# Altium schematic sheet sync-demod-ic.SchDoc: ADA2200
size A4; DrawnBy: Dylan Vogel; Organization: UTAT SS; DocumentNumber: 10; Revision: 2; SheetNumber: 10; SheetTotal: 13
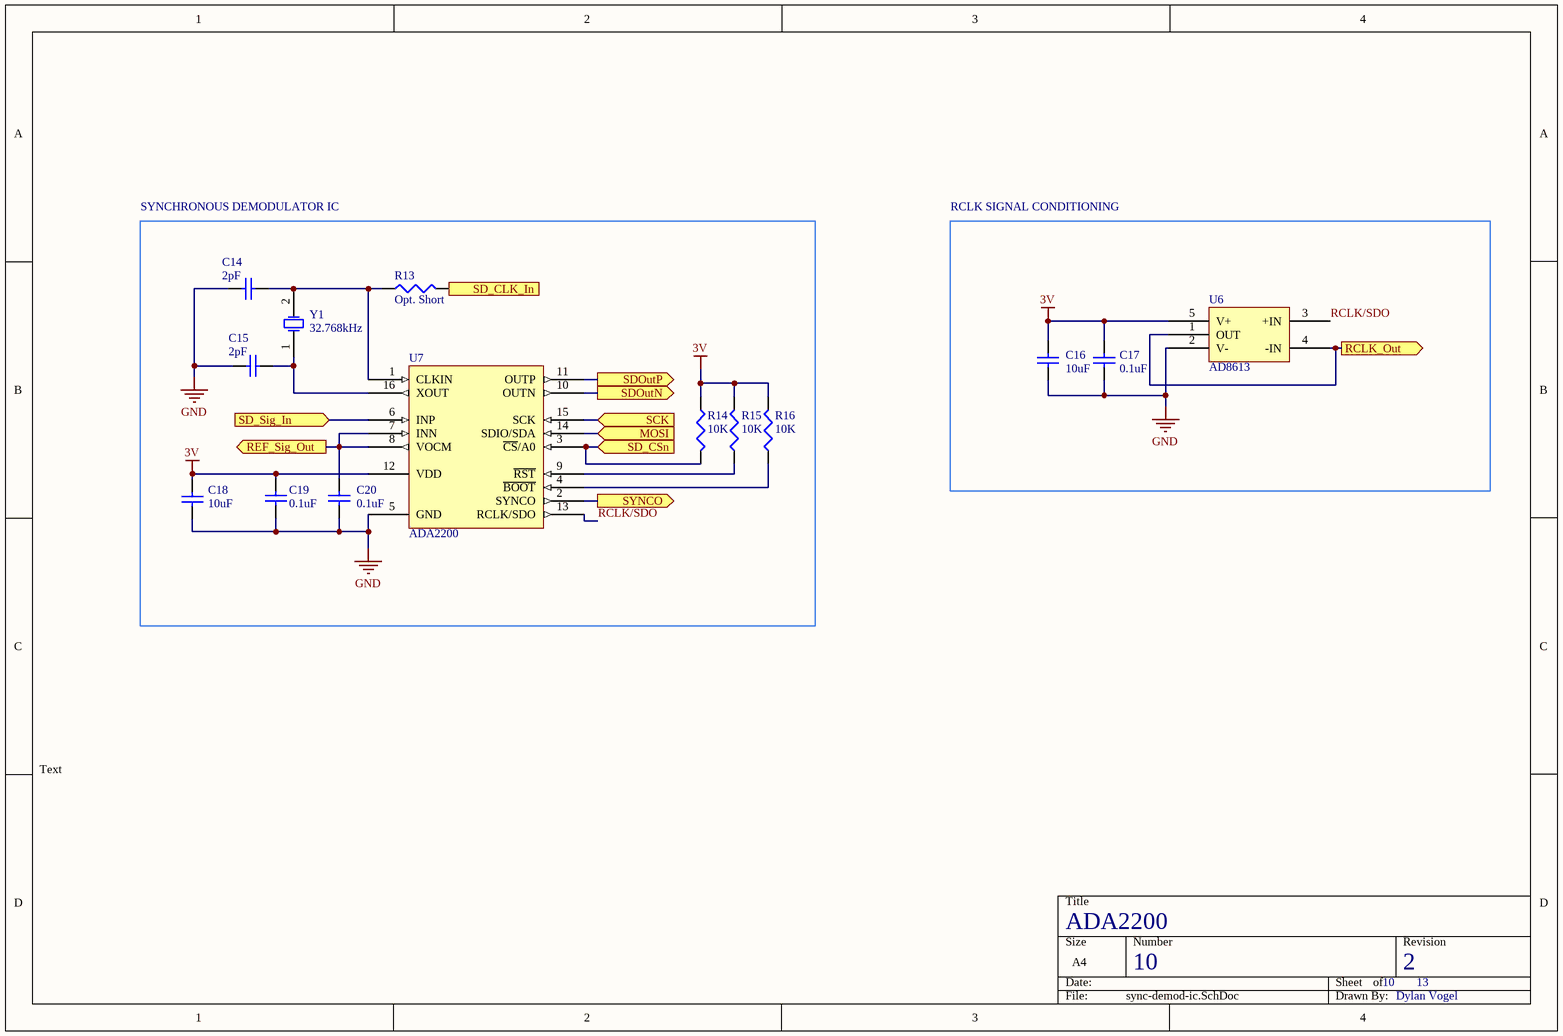
[diagram p0: sync-demod-ic.SchDoc]

## Parts
C14  2pF  [0402]
C15  2pF  [0402]
C16  10uF  [1608[0603]]
C17  0.1uF  [0402]
C18  10uF  [1608[0603]]
C19  0.1uF  [0402]
C20  0.1uF  [0402]
R13  Opt. Short  [0402]
R14  10K  [0402]
R15  10K  [0402]
R16  10K  [0402]
U6  AD8613  [SOP-65P200X125-5N]
U7  ADA2200  [SSOP16_N]
Y1  32.768kHz  [ABS07-120-32.768]

## Blocks framed on the sheet
SYNCHRONOUS DEMODULATOR IC: C14 C15 C18-C20 R13-R16 U7 Y1
RCLK SIGNAL CONDITIONING: C16 C17 U6

## Ports
MOSI (in), RCLK_Out (out), REF_Sig_Out (out), SCK (in), SD_CLK_In (in), SD_CSn (in), SD_Sig_In (in), SDOutN (out), SDOutP (out), SYNCO (out)

## Nets
3V: C16.2 C17.2 C18.1 C19.2 R14.1 R15.2 R16.2 U6.5(V+) U7.12(VDD)
GND: C14.2 C15.2 C16.1 C17.1 C18.2 C19.1 C20.1 U6.2(V-) U7.5(GND)
MOSI: U7.14(SDIO/SDA) ; port MOSI
RCLK/SDO: U6.3(+IN) U7.13(RCLK/SDO)
RCLK_Out: U6.1(OUT) U6.4(-IN) ; port RCLK_Out
REF_Sig_Out: C20.2 U7.7(INN) U7.8(VOCM) ; port REF_Sig_Out
SCK: U7.15(SCK) ; port SCK
SD_CLK_In: R13.2 ; port SD_CLK_In
SD_CSn: R14.2 U7.3(~{CS}/A0) ; port SD_CSn
SD_Sig_In: U7.6(INP) ; port SD_Sig_In
SDOutN: U7.10(OUTN) ; port SDOutN
SDOutP: U7.11(OUTP) ; port SDOutP
SYNCO: U7.2(SYNCO) ; port SYNCO
NetC14_1: C14.1 R13.1 U7.1(CLKIN) Y1.2(OSC2)
NetC15_1: C15.1 U7.16(XOUT) Y1.1(OSC1)
NetR15_1: R15.1 U7.9(~{RST})
NetR16_1: R16.1 U7.4(~{BOOT})

## Notes on the sheet
- Text

## Library data of the parts
C14-C20 = Cap Semi: Capacitor (Semiconductor SIM Model); Published: 8-Jun-2000; LatestRevisionDate: 29-May-2009; LatestRevisionNote: IPC-7351 Footprint Added.; PackageReference: C1206; Publisher: Altium Limited; PackageDescription: Chip Capacitor; Supplier: Digi-Key; Supplier 1: Digi-Key
  C14 C15: Value: 2pF
  C16 C18: Value: 10uF
  C17 C19 C20: Value: 0.1uF
R13 = Res3: Optional short to connect 32M1 rather than Y1; Value: 0 Ohm; Published: 8-Jun-2000; LatestRevisionDate: 29-May-2009; LatestRevisionNote: IPC-7351 Footprint Added.; PackageReference: J1-0603; Publisher: Altium Limited; PackageDescription: Chip Resistor; Supplier: Digi-Key; Supplier 1: Digi-Key
R14-R16 = Res3: Resistor; Published: 8-Jun-2000; LatestRevisionDate: 29-May-2009; LatestRevisionNote: IPC-7351 Footprint Added.; PackageReference: J1-0603; Publisher: Altium Limited; PackageDescription: Chip Resistor; Value: 10K; Supplier: Digi-Key; Supplier 1: Digi-Key
U6 = AD8613: Low power, low noise rail-to-rail op-amp.; Supplier: Digi-Key; Supplier 1: Digi-Key
U7 = ADA2200: Synchronous demodulator and configurable analog filter.; Supplier: Digi-Key; Supplier 1: Digi-Key
Y1 = XTAL: Crystal Oscillator; Published: 8-Jun-2000; LatestRevisionDate: 17-Jul-2002; LatestRevisionNote: Re-released for DXP Platform.; PackageReference: R38; Publisher: Altium Limited; PackageDescription: Crystal, Thru-Hole; 2 Leads; Body 3.1 x 8.2 mm (Dia.xH); Supplier: Digi-Key; Supplier Part Number: 535-11937-1-ND; Supplier 1: Digi-Key